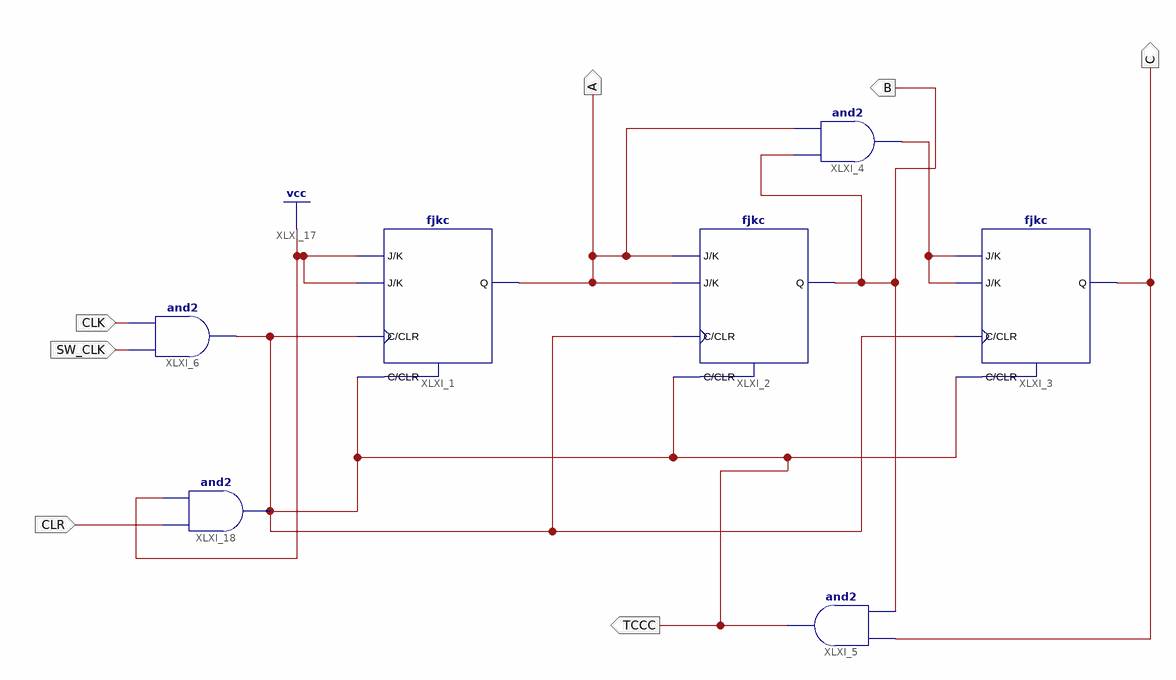
[diagram p0: schematic sheet 1]
// Xilinx ISE schematic COUNTER16NEW.sch (spartan6) as structural Verilog: 7 symbols, 7 ports
module COUNTER16NEW (
  input  SW_CLK,
  input  CLK,
  input  CLR,
  output A,
  output TCCC,
  output C,
  output B
);

  wire XLXN_11;

  fjkc XLXI_1 (.C(TCCC), .CLR(TCCC), .J(1'b1), .K(1'b1), .Q(A));
  fjkc XLXI_2 (.C(TCCC), .CLR(TCCC), .J(A), .K(A), .Q(B));
  fjkc XLXI_3 (.C(TCCC), .CLR(TCCC), .J(XLXN_11), .K(XLXN_11), .Q(C));
  and XLXI_4 (XLXN_11, B, A);
  and XLXI_5 (TCCC, B, C);
  and XLXI_6 (TCCC, SW_CLK, CLK);
  and XLXI_18 (TCCC, CLR, 1'b1);
endmodule
